# EAGLE design TA 2021 V.2 (EAGLE 7.2.0)
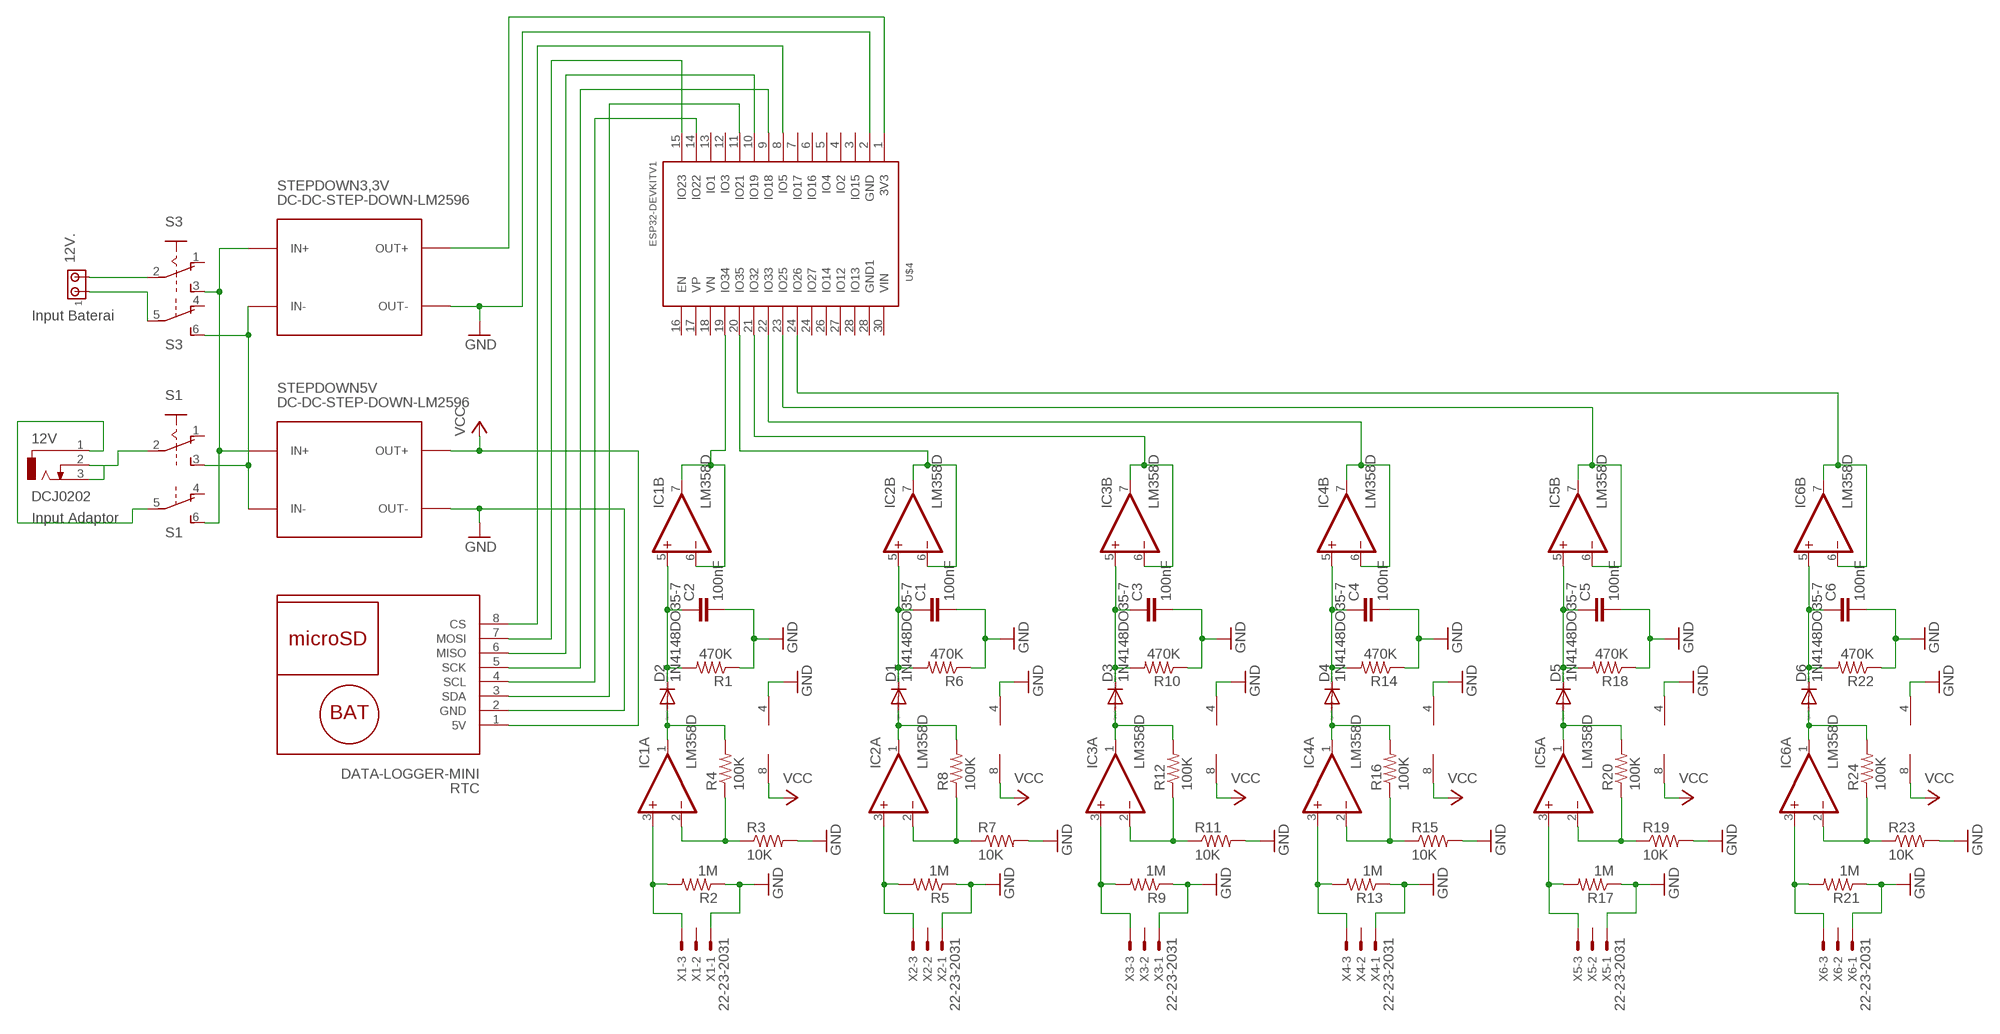
[diagram p0: schematic, sheet 1]

## Parts
12V  DCJ0202  [DCJ0202]
12V.  MTA02-156  [1X2MTA]
C1  100nF  C-EU075-032X103  [C075-032X103]
C2  100nF  C-EU075-032X103  [C075-032X103]
C3  100nF  C-EU075-032X103  [C075-032X103]
C4  100nF  C-EU075-032X103  [C075-032X103]
C5  100nF  C-EU075-032X103  [C075-032X103]
C6  100nF  C-EU075-032X103  [C075-032X103]
D1  1N4148DO35-7  [DO35-7]
D2  1N4148DO35-7  [DO35-7]
D3  1N4148DO35-7  [DO35-7]
D4  1N4148DO35-7  [DO35-7]
D5  1N4148DO35-7  [DO35-7]
D6  1N4148DO35-7  [DO35-7]
IC1  LM358D  [SO08]
IC2  LM358D  [SO08]
IC3  LM358D  [SO08]
IC4  LM358D  [SO08]
IC5  LM358D  [SO08]
IC6  LM358D  [SO08]
R1  470K  R-US_0207/10  [0207/10]
R2  1M  R-US_0207/10  [0207/10]
R3  10K  R-US_0207/10  [0207/10]
R4  100K  R-US_0207/10  [0207/10]
R5  1M  R-US_0207/10  [0207/10]
R6  470K  R-US_0207/10  [0207/10]
R7  10K  R-US_0207/10  [0207/10]
R8  100K  R-US_0207/10  [0207/10]
R9  1M  R-US_0207/10  [0207/10]
R10  470K  R-US_0207/10  [0207/10]
R11  10K  R-US_0207/10  [0207/10]
R12  100K  R-US_0207/10  [0207/10]
R13  1M  R-US_0207/10  [0207/10]
R14  470K  R-US_0207/10  [0207/10]
R15  10K  R-US_0207/10  [0207/10]
R16  100K  R-US_0207/10  [0207/10]
R17  1M  R-US_0207/10  [0207/10]
R18  470K  R-US_0207/10  [0207/10]
R19  10K  R-US_0207/10  [0207/10]
R20  100K  R-US_0207/10  [0207/10]
R21  1M  R-US_0207/10  [0207/10]
R22  470K  R-US_0207/10  [0207/10]
R23  10K  R-US_0207/10  [0207/10]
R24  100K  R-US_0207/10  [0207/10]
RTC  DATA-LOGGER-MINI  [DATA-LOGGER-MINI]
S1  A68-A31  [A68-A31]
S3  A68-A31  [A68-A31]
STEPDOWN3,3V  DC-DC-STEP-DOWN-LM2596  [DC-DC-STEP-DOWN-LM2596]
STEPDOWN5V  DC-DC-STEP-DOWN-LM2596  [DC-DC-STEP-DOWN-LM2596]
U$4  ESP32DEVKITV1  [ESP32-DEVKITV1]
X1  22-23-2031  [22-23-2031]
X2  22-23-2031  [22-23-2031]
X3  22-23-2031  [22-23-2031]
X4  22-23-2031  [22-23-2031]
X5  22-23-2031  [22-23-2031]
X6  22-23-2031  [22-23-2031]

## Nets
N$1: 12V..2 S3.2(A:P)
N$2: RTC.7(MOSI) U$4.15(IO23)
N$3: S1.6(B:S) S3.3(A:S) STEPDOWN3,3V.IN+ STEPDOWN5V.IN+
N$4: RTC.8(CS) U$4.8(IO5)
N$5: 12V.2 12V.3 S1.2(A:P)
N$6: RTC.6(MISO) U$4.10(IO19)
N$7: 12V..1 S3.5(B:P)
N$8: RTC.5(SCK) U$4.9(IO18)
N$9: 12V.1 S1.5(B:P)
N$10: C1.2 C2.2 C3.2 C4.2 C5.2 C6.2 IC1.4(P:V-) IC2.4(P:V-) IC3.4(P:V-) IC4.4(P:V-) IC5.4(P:V-) IC6.4(P:V-) R1.1 R2.1 R3.2 R5.1 R6.1 R7.2 R9.1 R10.1 R11.2 R13.1 R14.1 R15.2 R17.1 R18.1 R19.2 R21.1 R22.1 R23.2 RTC.2(GND) STEPDOWN3,3V.OUT- STEPDOWN5V.OUT- U$4.2(GND) X1.1 X2.1 X3.1 X4.1 X5.1 X6.1 ; supply symbol labelled GND
N$11: S1.3(A:S) S3.6(B:S) STEPDOWN3,3V.IN- STEPDOWN5V.IN-
N$12: IC2.6(B:-IN) IC2.7(B:OUT) U$4.20(IO35)
N$13: D1.A IC2.1(A:OUT) R8.2
N$15: IC2.2(A:-IN) R7.1 R8.1
N$16: RTC.4(SCL) U$4.14(IO22)
N$17: IC3.6(B:-IN) IC3.7(B:OUT) U$4.21(IO32)
N$18: STEPDOWN3,3V.OUT+ U$4.1(3V3)
N$20: IC4.6(B:-IN) IC4.7(B:OUT) U$4.22(IO33)
N$21: IC5.6(B:-IN) IC5.7(B:OUT) U$4.23(IO25)
N$22: IC6.6(B:-IN) IC6.7(B:OUT) U$4.24(IO26)
N$23: RTC.3(SDA) U$4.11(IO21)
N$24: IC1.3(A:+IN) R2.2 X1.3
N$68: C1.1 D1.C IC2.5(B:+IN) R6.2
N$69: D2.A IC1.1(A:OUT) R4.2
N$70: IC1.2(A:-IN) R3.1 R4.1
N$71: C2.1 D2.C IC1.5(B:+IN) R1.2
N$72: D4.A IC4.1(A:OUT) R16.2
N$73: IC1.6(B:-IN) IC1.7(B:OUT) U$4.19(IO34)
N$74: IC2.3(A:+IN) R5.2 X2.3
N$75: D3.A IC3.1(A:OUT) R12.2
N$77: C3.1 D3.C IC3.5(B:+IN) R10.2
N$78: D6.A IC6.1(A:OUT) R24.2
N$79: IC3.3(A:+IN) R9.2 X3.3
N$80: IC4.2(A:-IN) R15.1 R16.1
N$82: IC6.2(A:-IN) R23.1 R24.1
N$83: IC4.3(A:+IN) R13.2 X4.3
N$84: D5.A IC5.1(A:OUT) R20.2
N$85: IC5.2(A:-IN) R19.1 R20.1
N$86: C5.1 D5.C IC5.5(B:+IN) R18.2
N$88: IC5.3(A:+IN) R17.2 X5.3
N$91: IC6.3(A:+IN) R21.2 X6.3
N$99: IC3.2(A:-IN) R11.1 R12.1
N$155: C6.1 D6.C IC6.5(B:+IN) R22.2
N$185: C4.1 D4.C IC4.5(B:+IN) R14.2
VCC: IC1.8(P:V+) IC2.8(P:V+) IC3.8(P:V+) IC4.8(P:V+) IC5.8(P:V+) IC6.8(P:V+) RTC.1(5V) STEPDOWN5V.OUT+
Unconnected: S1.1(A:O) S1.4(B:O) S3.1(A:O) S3.4(B:O) U$4.3(IO15) U$4.4(IO2) U$4.5(IO4) U$4.6(IO16) U$4.7(IO17) U$4.12(IO3) U$4.13(IO1) U$4.16(EN) U$4.17(VP) U$4.18(VN) U$4.24(IO27) U$4.26(IO14) U$4.27(IO12) U$4.28(GND1) U$4.28(IO13) U$4.30(VIN) X1.2 X2.2 X3.2 X4.2 X5.2 X6.2

## Notes on the sheet
- Input Baterai
- Input Adaptor

## Library data of the parts
12V = con-jack:DCJ0202: DC POWER JACK Source: DCJ0202.pdf; OC_FARNELL: unknown; OC_NEWARK: unknown
12V. = con-amp:MTA02-156: AMP connector
C1-C6 = rcl:C-EU: CAPACITOR, European symbol
D1-D6 = diode:1N4148: DIODE high speed (Philips)
IC1-IC6 = linear:LM358: OP AMP also LM158; LM258; LM2904 Source: http://cache.national.com/ds/LM/LM158.pdf
R1-R24 = resistor:R-US_: RESISTOR, American symbol
RTC = diy-modules (1):DATA-LOGGER-MINI: Mini Data Logger with microSD card and battery powered RTC based on DS1307 chip Arduino library for DS1307 and description are available here: https://www.pjrc.com/teensy/td_libs_DS1307RTC.html Tutorial how to use SD card with Arduino: https://www.arduino.cc/en/reference/SD Click here to find device on ebay.com <http://www.ebay.com/sch/mini+data+logger+arduino>
S1 S3 = switch:A68-A31: SLIDING SWITCH Siemens, distributor Buerklin, 11G766
STEPDOWN3,3V STEPDOWN5V = diy-modules:DC-DC-STEP-DOWN-LM2596: DC/DC Step-Down Regulator based on LM2596-ADJ chip
U$4 = ESP32-DEVKITV1:ESP32DEVKITV1
X1-X6 = con-molex:22-23-2031: .100" (2.54mm) Center Header - 3 Pin; MF: MOLEX; MPN: 22-23-2031; OC_FARNELL: 1462950; OC_NEWARK: 30C0862

## Board
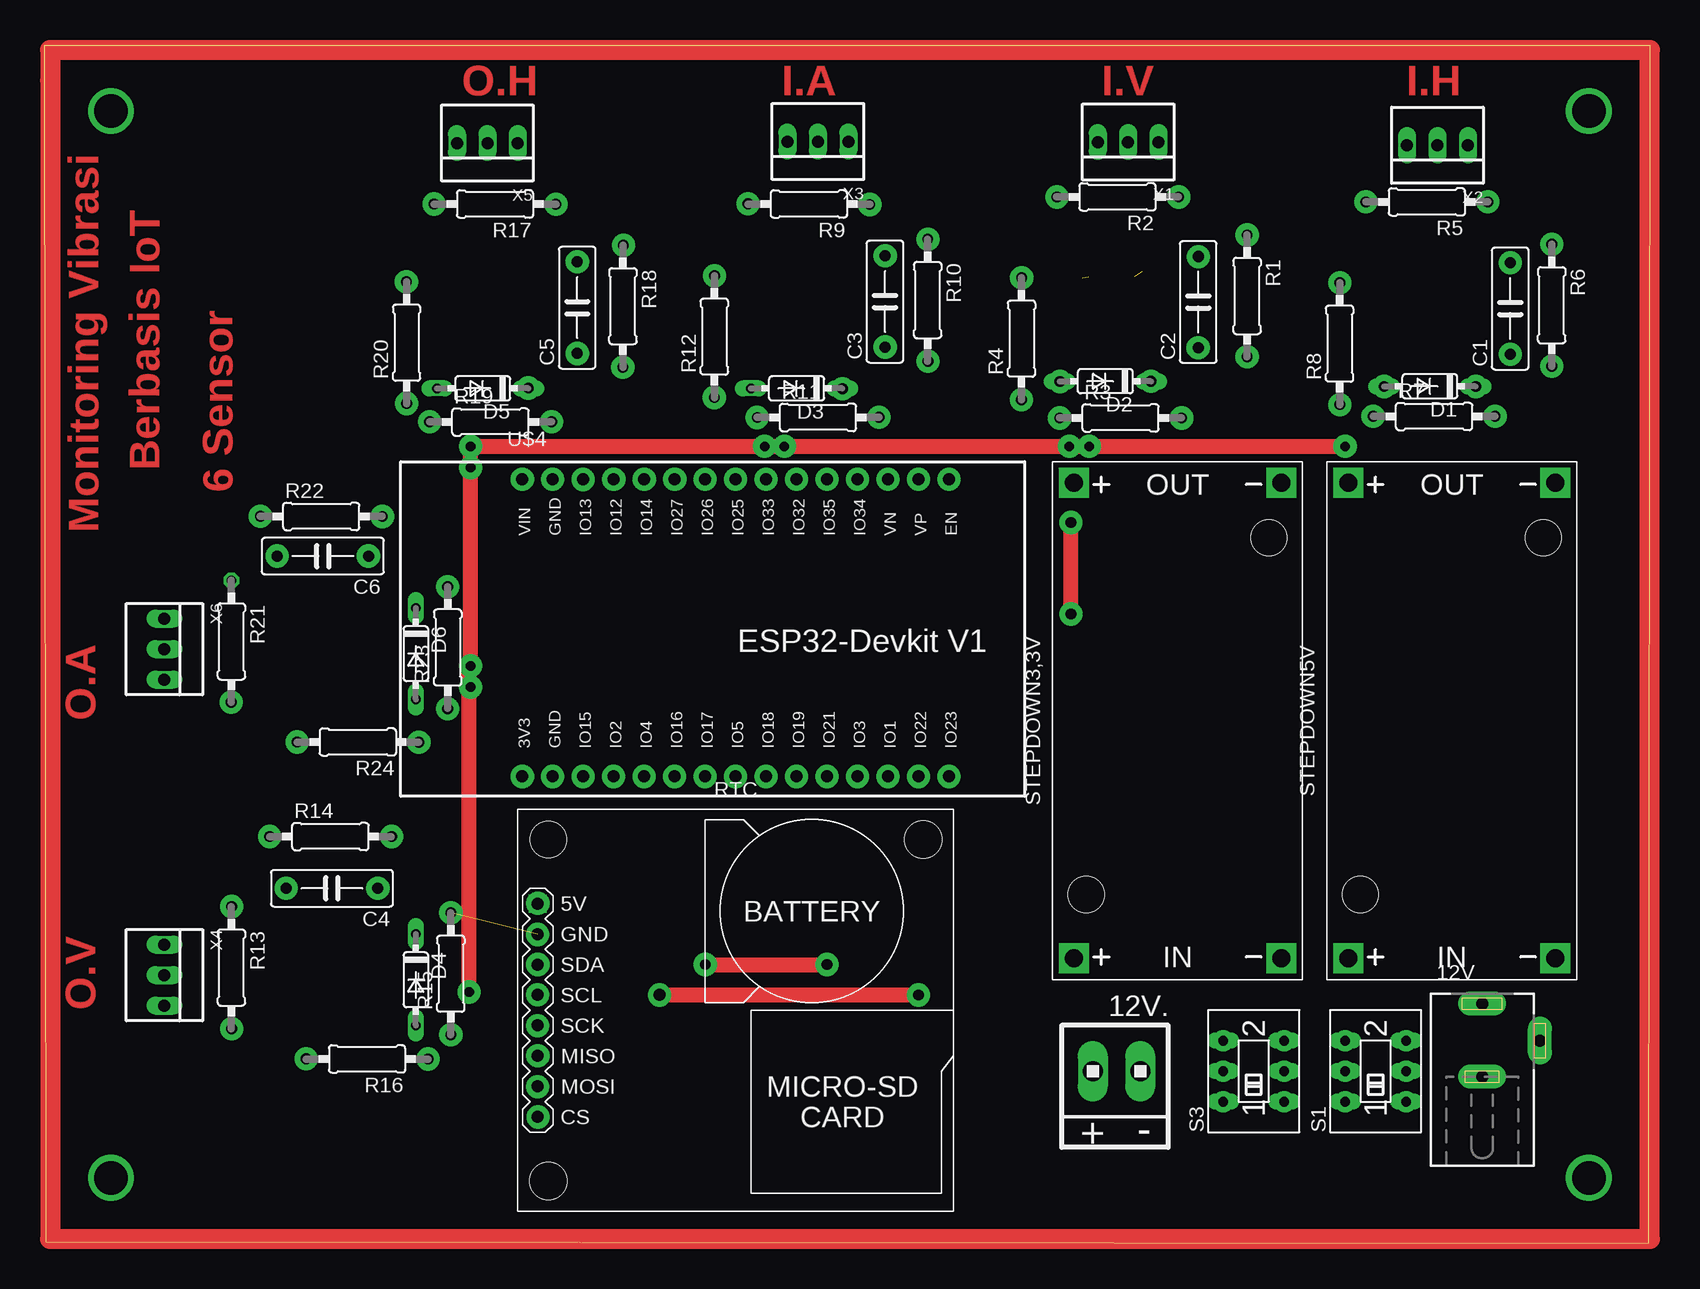
[diagram p1: board, top side]
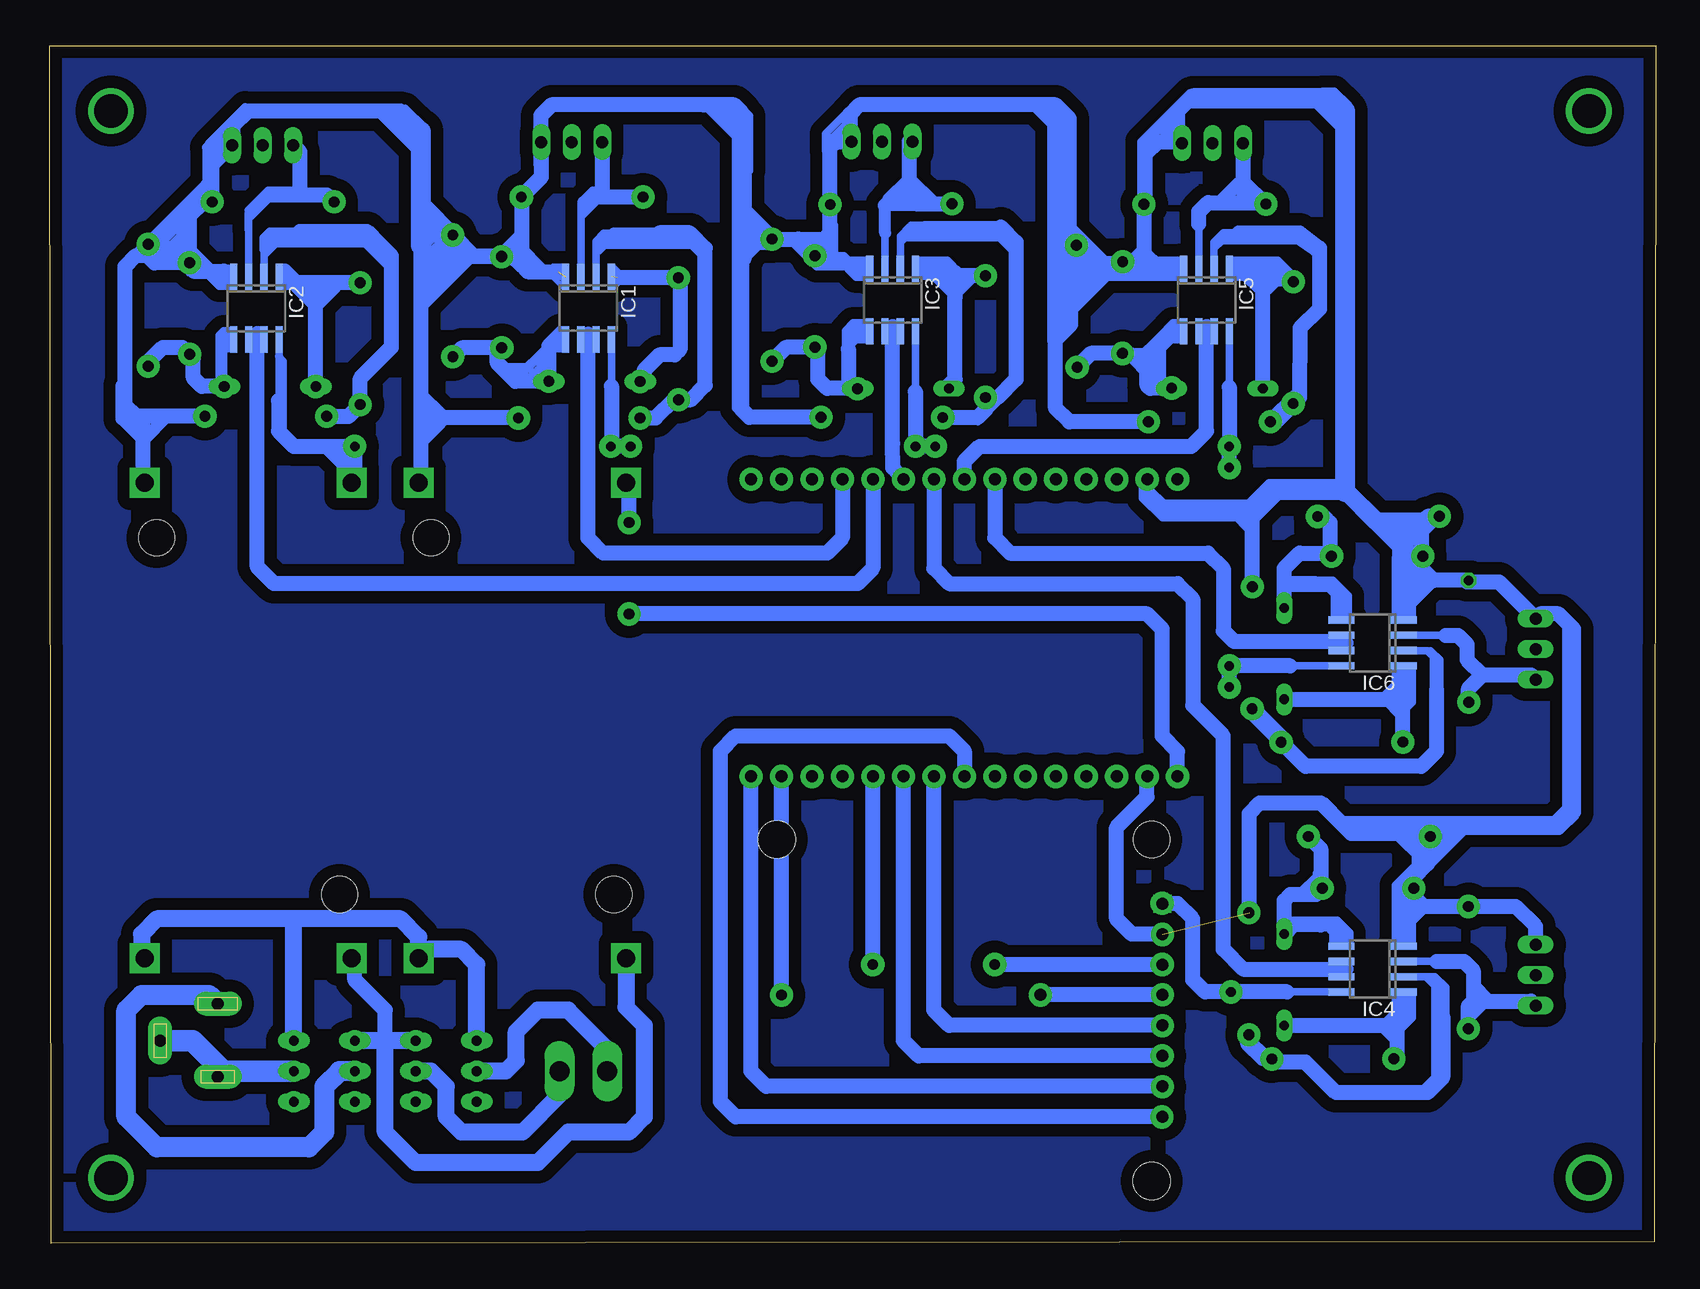
[diagram p2: board, bottom side, seen from below]

Size 133.91 x 99.81 mm. Coordinates in mm from the lower left corner, seen from the top.
Outline: 0.13,0.13 133.78,0 133.91,99.81 0,99.81 0.13,0.13
Copper layers (1*16): Top 0.035mm / dielectric 1.5mm / Bottom 0.035mm
Design rules "default": minimum track width 10mil, minimum drill 24mil, track to track 8mil, track to pad 8mil, pad to pad 8mil, via to via 8mil, smd to smd 8mil, copper to edge 40mil, drill to drill 8mil, minimum pad ring 10mil, minimum via ring 8mil, stop-mask expansion 4mil, vias tented up to drill 0mil, thermal gap 10mil

### Footprints (pad centres in the part's own frame; a part is rotated, then mirrored left to right if it is on the bottom)
DCJ0202 = drill 1 pad 2 long: 1 0,3.1; 2 4.8,0; 3 0,-3
1X2MTA = drill 1.676 long: 1 1.981,0; 2 -1.981,0
C075-032X103 = drill 0.914 octagon: 1 -3.81,0; 2 3.81,0
DO35-7 = drill 0.813 long: A 3.81,0; C -3.81,0
SO08 = smd 0.6 x 2.2: 1 -1.905,-2.6; 2 -0.635,-2.6; 3 0.635,-2.6; 4 1.905,-2.6; 5 1.905,2.6; 6 0.635,2.6; 7 -0.635,2.6; 8 -1.905,2.6
0207/10 = drill 0.813 octagon: 1 -5.08,0; 2 5.08,0
DATA-LOGGER-MINI = drill 1 square: 1 -16.51,8.89 | drill 1: 2 -16.51,6.35; 3 -16.51,3.81; 4 -16.51,1.27; 5 -16.51,-1.27; 6 -16.51,-3.81; 7 -16.51,-6.35; 8 -16.51,-8.89 | hole 3: -15.621,14.224 | hole 3.1: -15.621,-14.224; 15.621,14.224
A68-A31 = drill 0.813 long: 1 -2.54,-2.54; 2 0,-2.54; 3 2.54,-2.54; 4 -2.54,2.54; 5 0,2.54; 6 2.54,2.54
DC-DC-STEP-DOWN-LM2596 = drill 1.5 pad 2.5 square: IN+ -19.812,8.636; IN- -19.812,-8.636; OUT+ 19.812,8.636; OUT- 19.812,-8.636 | hole 3: -14.478,7.62; 15.24,-7.62
ESP32-DEVKITV1 = drill 1 pad 1.93: 1 -22.87,-13.54; 2 -20.33,-13.54; 3 -17.79,-13.54; 4 -15.25,-13.54; 5 -12.71,-13.54; 6 -10.17,-13.54; 7 -7.63,-13.54; 8 -5.09,-13.54; 9 -2.55,-13.54; 10 -0.01,-13.54; 11 2.53,-13.54; 12 5.07,-13.54; 13 7.61,-13.54; 14 10.15,-13.54; 15 12.69,-13.54; 16 12.69,11.23; 17 10.15,11.23; 18 7.61,11.23; 19 5.07,11.23; 20 2.53,11.23; 21 -0.01,11.23; 22 -2.55,11.23; 23 -5.09,11.23; 24 -7.63,11.23; 25 -10.17,11.23; 26 -12.71,11.23; 27 -15.25,11.23; 28 -17.79,11.23; 29 -20.33,11.23; 30 -22.87,11.23
22-23-2031 = drill 1 long: 1 -2.54,0; 2 0,0; 3 2.54,0

### Placement (x,y rotation side)
12V  119.89,16.89 0 top
12V.  89.41,14.35 180 top
C1  122.22,77.9 90 top
C2  96.22,78.45 90 top
C3  70.1,78.49 90 top
C4  24,29.59 180 top
C5  44.45,77.98 90 top
C6  23.24,57.28 180 top
D1  115.52,71.42 180 top
D2  88.47,71.84 180 top
D3  62.74,71.25 180 top
D4  30.99,21.97 270 top
D5  36.58,71.25 180 top
D6  30.99,49.15 270 top
IC1  88.98,77.94 180 bottom
IC2  116.66,77.93 180 bottom
IC3  63.63,78.61 180 bottom
IC4  23.62,22.86 90 bottom
IC5  37.47,78.61 180 bottom
IC6  23.62,50.04 90 bottom
R1  100.28,78.96 270 top
R2  89.48,87.21 180 top
R3  89.74,68.8 0 top
R4  81.48,75.4 90 top
R5  115.27,86.79 180 top
R6  125.68,78.18 270 top
R7  115.87,68.91 0 top
R8  108,74.98 90 top
R9  63.75,86.61 180 top
R10  73.66,78.61 270 top
R11  64.52,68.83 0 top
R12  55.88,75.56 90 top
R13  15.62,22.99 270 top
R14  23.88,33.91 0 top
R15  33.91,22.48 90 top
R16  26.92,15.37 180 top
R17  37.59,86.61 180 top
R18  48.26,78.1 270 top
R19  37.21,68.45 0 top
R20  30.23,75.06 90 top
R21  15.62,50.16 270 top
R22  23.11,60.58 0 top
R23  33.66,49.66 90 top
R24  26.16,41.78 180 top
RTC  57.66,19.43 0 top
S1  111,14.35 90 top
S3  100.84,14.35 90 top
STEPDOWN3,3V  94.49,43.56 90 top
STEPDOWN5V  117.35,43.56 90 top
U$4  62.74,52.45 0 top
X1  90.37,91.78 180 top
X2  116.15,91.52 180 top
X3  64.52,91.82 180 top
X4  10.03,22.35 270 top
X5  36.96,91.69 180 top
X6  10.03,49.53 270 top

### Tracks (layer width: path | path; a pad name or v marks a point on that pad's centre or on a via)
N$1
  Bottom 1.422: 12V..2 91.39,12.37 94.49,9.27 99.57,9.27 100.84,10.54 100.84,13.08 102.11,14.35 S3.2
N$2
  Bottom 1.27: RTC.7 74.17,13.08 75.44,14.35 U$4.15
N$3
  Bottom 1.27: 105.92,16.89 105.92,19.43 108.46,21.97 108.46,23.5
  Bottom 1.422: S3.3 105.92,16.89 | 105.92,16.89 S1.6 | STEPDOWN3,3V.IN+ 85.85,19.69 84.33,18.16 84.33,10.54 85.6,9.27 90.68,9.27 93.22,6.73 103.38,6.73 105.92,9.27 105.92,16.89
  Bottom 1.778: 108.46,23.5 STEPDOWN5V.IN+
N$4
  Bottom 1.27: RTC.8 76.71,10.54 77.98,11.81 77.98,41.02 76.71,42.29 58.93,42.29 57.66,41.02 U$4.8
N$5
  Bottom 1.778: S1.2 119.43,14.35 | 119.43,14.35 12V.3 | 12V.2 121.97,16.89 119.43,14.35
N$6
  Bottom 1.27: RTC.6 61.47,15.62 62.74,16.89 U$4.10
N$7
  Bottom 1.422: 12V..1 87.43,16.18 90.68,19.43 93.22,19.43 95,17.65 95,15.24 95.89,14.35 S3.5
N$8
  Bottom 1.27: RTC.5 58.93,18.16 60.2,19.43 U$4.9
N$9
  Bottom 1.676: S1.5 109.73,14.35 111,13.08 111,9.27 112.27,8 124.97,8 127.51,10.54 127.51,19.43 126.24,20.7 120.6,20.7 12V.1
N$10  (via drill 0.9 pad 1.93)  (2 unrouted)
  Bottom 0.61: 119.38,81.03 119.07,81.03 IC2.4 | IC4.4 21.02,27.25 | IC5.4 41.97,81.21 43.05,82.3 | IC6.4 21.02,54.8 | 76.2,91.69 76.71,92.2 | 76.71,93.85 77.22,94.36 77.72,94.36 76.58,93.22 76.58,92.71 78.74,94.87 79.38,94.87 76.71,92.2 | 76.71,91.69 76.71,92.2 | IC3.4 66.99,81.21 68.07,82.3 C3.2
  Bottom 0.813: 44.96,80.64 45.72,80.64 48.77,77.6 48.77,78.23 46.23,80.77 46.61,80.77 48.26,82.42 48.26,79.63 48.01,79.38 48.01,79.88 47.24,80.64 47.5,80.64 47.88,81.03
  Bottom 1.016: 124.08,68.83 124.21,68.83 125.98,67.06 126.24,67.06 127.89,68.71 127.89,71.5 127.64,71.75
  Bottom 1.27: R2.1 94.56,83.91 | R2.1 94.56,81.5 | 94.56,81.5 94.06,80.99 91.52,80.99 | R3.2 102.18,68.8 102.95,69.56 | 102.95,69.56 102.95,83.15 102.06,84.04 v100.29,84.04 R1.1 98.5,82.26 C2.2 95.33,82.26 94.56,81.5 | X1.1 92.91,89.92 | 92.91,89.92 92.91,88.86 R2.1 | C1.2 125.15,81.71 125.73,82.3 | 125.73,82.3 125.73,83.21 R6.1 | C1.2 122.23,85.67 121.16,86.74 120.4,86.74 R5.1 120.35,91.36 119.89,91.82 119,91.82 X2.1 118.62,91.59 118.62,93.09 117.35,94.36 104.65,94.36 102.95,92.66 | C1.2 122.23,81.33 121.92,81.03 119.38,81.03 | R7.2 126.11,68.91 | 126.11,68.91 126.7,68.91 127.64,69.85 127.64,71.75 127.64,81.41 126.75,82.3 125.73,82.3 | 71.5,83.69 R10.1 73.91,83.44 74.93,83.44 76.2,82.17 76.2,69.47 75.56,68.83 R11.2 | 71.5,83.69 C3.2 | 20.32,29.08 19.3,28.07 R13.1 11.68,28.07 10.03,26.42 X4.1 | 20.32,29.08 20.32,29.46 C4.2 v20.19,29.6 20.19,30.48 19.05,31.62 19.05,33.66 R14.1 19.05,34.16 25.4,34.16 25.91,34.67 | 21.02,27.25 21.02,28.38 20.32,29.08 | R15.2 33.91,35.81 33.02,36.7 27.94,36.7 25.91,34.67 | R19.2 48.89,68.45 50.04,69.6 50.04,75.31 | 50.04,75.31 48.77,76.58 48.77,77.6 48.77,82.68 R18.1 47.75,83.18 46.23,81.66 44.58,81.66 C5.2 44.32,81.66 43.69,81.66 43.05,82.3 42.67,82.68 v42.67,86.6 R17.1 42.55,86.74 42.55,90.8 41.53,91.82 39.62,91.82 X5.1 39.88,92.07 39.88,94.36 38.61,95.63 27.18,95.63 25.91,94.36 | R22.1 19.05,60.58 19.56,60.07 | 19.56,60.07 19.56,57.4 v19.44,57.29 | v19.44,57.29 C6.2 | C6.2 19.56,57.15 19.56,56.26 18.54,55.25 R21.1 15.75,55.12 13.08,55.12 X6.1 9.65,52.45 8.13,52.45 6.86,51.18 6.86,35.94 8.13,34.67 25.91,34.67 | 21.02,54.8 21.02,57.34 20.83,57.53 19.69,57.53 v19.44,57.29
  Bottom 1.27: v19.44,57.29 C6.2 | R23.2 33.66,61.21 33.53,61.34 | 19.56,60.07 23.37,60.07 25.91,62.61 32.26,62.61 33.53,61.34 | 126.11,63.37 126.11,68.91 | 102.95,63.37 102.95,69.56 | 76.2,91.69 76.2,94.23 76.83,94.87 79.38,94.87 92.08,94.87 92.96,93.98 92.96,89.97 92.91,89.92 | 50.04,75.31 50.04,75.56 48.89,76.71 48.89,93.73 50.04,94.87 66.42,94.87 67.18,94.11 67.18,91.95 X3.1 68.33,91.82 68.83,91.31 R9.1 v68.83,86.58 68.83,84.2 69.34,83.69 71.5,83.69 | RTC.2 43.69,25.78 44.96,27.05 44.96,34.67 42.42,37.21 U$4.2 | 33.53,61.34 41.15,61.34 42.42,62.61 42.42,63.88
  Bottom 1.676: 102.95,83.15 102.95,92.66 | 76.2,82.17 76.2,91.69 | 25.91,62.61 25.91,94.36
  Bottom 1.778: STEPDOWN5V.OUT- 126.11,63.37 | STEPDOWN3,3V.OUT- 102.95,63.37
N$11
  Bottom 1.422: 113.54,27.05 104.65,27.05 103.12,25.53 STEPDOWN3,3V.IN- 102.36,24.51 99.57,24.51 98.3,23.24 S3.6 | 113.54,27.05 124.97,27.05 126.24,25.78 126.24,24 STEPDOWN5V.IN- | S1.3 113.54,27.05
N$12
  Bottom 0.61: IC2.7 IC2.6 116.8,75.82 116.59,75.82
  Bottom 1.27: U$4.20 65.27,56.27 66.55,54.99 115.19,54.99 116.59,56.39 116.59,75.82
N$13
  Bottom 0.61: 114.3,81.03 114.3,80.98 IC2.1
  Bottom 1.27: R8.2 111.76,80.06 | 111.76,80.06 113.33,80.06 114.3,81.03 | D1.A 111.71,80.01 111.76,80.06
N$14
  Bottom 1.016: 88.98,75.91 88.98,74.74
N$15
  Bottom 0.61: IC2.2 116.03,83.87 | 113.03,84.33 115.57,84.33 116.03,83.87 | 106.43,83.31 114.55,83.31 115.06,83.31 | 115.06,83.31 115.57,83.31 116.08,82.8 116.08,83.82 116.03,83.87 | 115.06,83.31 115.95,82.42
  Bottom 1.27: R7.1 108.99,68.91 R8.1 108,72.08 105.41,74.68 105.41,82.3 106.43,83.31 107.44,84.33 113.03,84.33
N$16  (via drill 0.9 pad 1.93, 1 pad 1.93)
  Top 1.27: v51.31,20.7 v72.9,20.7
  Bottom 1.27: RTC.4 v51.31,20.7 | v72.9,20.7 U$4.14
N$17
  Bottom 0.61: IC3.6 63.63,76.39 IC3.7
  Bottom 1.27: U$4.21 63.62,64.63 63.63,66.67 63.63,76.39
N$18  (via drill 0.9 pad 1.93)
  Top 1.27: v85.6,52.45 v85.6,60.07
  Bottom 1.27: U$4.1 39.87,41.01 41.15,42.29 41.15,51.18 42.42,52.45 v85.6,52.45 | v85.6,60.07 85.6,63.12
  Bottom 1.93: 85.6,63.12 STEPDOWN3,3V.OUT+
N$19
  Bottom 0.61: 118.74,76.07 119.13,76.07 | 119.13,76.07 119.51,75.69 119.51,75.18 | 119.51,71.5 119.51,75.18 | 119.51,75.18 119.13,75.56 119.13,74.68 119,74.55 | 119.13,76.07 119.38,76.07 119.76,75.69 119.76,71.37 119.63,71.25
N$20
  Bottom 0.61: IC4.6 25.84,22.86 IC4.7
  Bottom 1.27: 25.84,22.86 34.42,22.86 36.07,24.51 36.07,42.29 38.61,44.83 38.61,53.72 39.88,54.99 58.93,54.99 60.19,56.25 U$4.22
N$21
  Bottom 0.61: IC5.7 37.47,76.39 IC5.6
  Bottom 1.27: U$4.23 57.65,65.16 56.39,66.42 38.73,66.42 37.47,67.69 37.47,76.39
N$22
  Bottom 0.61: IC6.6 25.84,50.04 IC6.7
  Bottom 1.27: 25.84,50.04 26.35,50.16 35.18,50.16 36.07,51.05 36.07,56.26 37.34,57.53 53.85,57.53 55.11,58.79 U$4.24
N$23  (via drill 0.9 pad 1.93)
  Top 1.27: v55.12,23.24 v65.28,23.24
  Bottom 1.27: RTC.3 v41.16,23.24 v55.12,23.24 | v65.28,23.24 U$4.11
N$24
  Bottom 0.61: IC1.3 89.61,86.79 89.53,86.87 89.28,87.12 | 89.28,87.12 87.72,87.12 87.63,87.21 | 87.88,87.76 88.65,87.76 89.28,87.12
  Bottom 1.27: R2.2 87.63,87.21 88.09,87.21 87.83,87.46 X1.3
N$25
  Bottom 0.61: 118.62,79.76 119.76,79.76 120.9,80.9 120.14,80.9 119.13,79.88 119.13,80.26 119,80.39 119,81.28
N$26
  Bottom 0.61: 113.16,79.76 114.43,79.76 114.55,79.88 114.3,80.14
N$27
  Bottom 0.61: 109.98,80.14 109.98,79.5 111.51,77.98 111.89,77.98 113.54,79.63 112.78,79.63 112.14,78.99 111.13,78.99 110.62,79.5
N$28
  Bottom 0.61: 113.28,87.76 115.19,87.76 115.44,87.76 | 115.44,87.76 117.35,85.85 117.35,84.45 | 115.44,87.76 115.7,87.76 117.35,86.11
N$29
  Bottom 0.61: 118.62,91.44 118.62,91.19 119.89,89.92 119.89,90.42 119.13,91.19 119.38,91.19 119.51,91.06
N$30  (via drill 0.8 pad 1.78)
  other vias: 70.36,63.75
N$31  (via drill 0.8 pad 1.78)
  other vias: 72.9,63.75
N$32  (via drill 0.8 pad 1.78)
  other vias: 75.44,63.75
N$33  (via drill 0.8 pad 1.78)
  other vias: 44.96,38.86
N$34  (via drill 0.8 pad 1.78)
  other vias: 42.42,38.86
N$35  (via drill 0.8 pad 1.78)
  other vias: 39.88,38.86
N$36  (via drill 0.8 pad 1.78)
  other vias: 47.5,38.86
N$37  (via drill 0.8 pad 1.78)
  other vias: 50.04,38.86
N$38  (via drill 0.8 pad 1.78)
  other vias: 52.58,38.86
N$39  (via drill 0.8 pad 1.78)
  other vias: 55.12,38.86
N$40  (via drill 0.8 pad 1.78)
  other vias: 57.66,38.86
N$41  (via drill 0.8 pad 1.78)
  other vias: 67.82,38.86
N$42  (via drill 0.8 pad 1.78)
  other vias: 70.36,38.86
N$43
  Bottom 0.61: 120.65,91.57 120.65,91.69 117.6,94.74 117.6,94.23 119.38,92.46
N$44
  Bottom 0.61: 106.43,94.11 103.25,90.93 103.25,91.69 105.41,93.85 104.9,93.85 103.25,92.2
N$45
  Bottom 0.61: 99.82,84.07 102.62,86.87 102.62,86.23 100.97,84.58 101.6,84.58 102.36,85.34 102.36,84.84 102.11,84.58
N$46
  Bottom 0.61: 35.31,81.91 31.5,81.91 29.97,80.39 30.61,80.39 31.88,81.66 35.18,81.66 35.31,81.53 34.16,81.53 33.53,80.9 33.53,81.03 33.4,81.15 31.75,81.15
N$47
  Bottom 0.61: 101.09,68.83 101.09,69.21 102.74,70.87 102.74,70.48 101.73,69.47
N$48
  Bottom 0.61: 101.22,68.45 101.22,68.2 102.62,66.8 102.62,67.56 101.85,68.33
N$49
  Bottom 0.61: 101.98,67.56 101.85,67.56 100.97,68.45
N$50
  Bottom 0.61: 87.38,87.38 87.76,87.38 89.53,85.6 89.53,86.23 88.9,86.87
N$51
  Bottom 0.406: 90.88,74.45 91.58,74.45 | 91.59,74.45 91.58,74.45 | 91.58,74.45 91.2,74.83
N$52
  Bottom 0.406: 91,76.24 91.42,76.24 92.61,75.04
N$53
  Bottom 0.813: 95.19,72.03 95,72.03 92.23,74.8
N$54
  Bottom 0.813: 92.75,73.67 92.75,73.14 93.74,72.15
N$55  (via drill 0.8 pad 1.78)
  other vias: 113.54,11.81
N$56  (via drill 0.8 pad 1.78)
  other vias: 113.54,14.35
N$57  (via drill 0.8 pad 1.78)
  other vias: 113.54,16.89
N$58  (via drill 0.8 pad 1.78)
  other vias: 108.46,16.89
N$59  (via drill 0.8 pad 1.78)
  other vias: 108.46,14.35
N$60  (via drill 0.8 pad 1.78)
  other vias: 108.46,11.81
N$61  (via drill 0.8 pad 1.78)
  other vias: 98.3,16.89
N$62  (via drill 0.8 pad 1.78)
  other vias: 98.3,14.35
N$63  (via drill 0.8 pad 1.78)
  other vias: 98.3,11.81
N$64  (via drill 0.8 pad 1.78)
  other vias: 103.38,16.89
N$65  (via drill 0.8 pad 1.78)
  other vias: 103.38,11.81
N$66  (via drill 0.8 pad 1.78)
  other vias: 103.38,14.35
N$67
  Bottom 0.813: 93.97,72.94 95.9,72.94 96.19,72.64
N$68
  Bottom 0.61: IC2.5 118.73,75.33 119.38,74.68 119.38,71.48 D1.C
  Bottom 1.27: D1.C 121.21,71.42 121.92,72.14 121.92,73.79 C1.1 122.81,74.68 124.46,74.68 125.68,73.46 R6.2
N$69  (via drill 0.9 pad 1.93)  (1 unrouted)
  Bottom 1.27: 86.56,80.48 v81.5,80.48 R4.2 81.36,80.35 81.36,74.47 81.79,74.04 83.06,74.04 84.33,72.77 84.33,72.17 D2.A 84.15,71.84
N$70
  Bottom 0.61: IC1.2 88.34,83.53 87.71,84.16 86.69,84.16
  Bottom 0.813: 83.06,84.2 85.56,84.2 86.87,84.16
  Bottom 1.016: 86.87,84.16 86.69,84.16 82.5,84.16 | 81.23,70.32 R4.1
  Bottom 1.27: R3.1 83.39,68.8 81.86,70.32 R4.1 80.43,70.32 79.25,71.5 79.25,82.93 80.52,84.2 83.06,84.2
N$71  (via drill 0.9 pad 1.93)
  Bottom 0.61: 91.52,75.53 91.07,75.53 IC1.5
  Bottom 1.27: R1.2 99.52,74.64 C2.1 96.6,74.26 96.6,73.37 95.07,71.84 D2.C v92.28,71.86 92.28,74.77 91.52,75.53
N$72
  Bottom 0.61: IC4.1 21.02,19.24 22.1,18.16
  Bottom 1.27: D4.A 22.1,18.16 21.59,17.65 21.59,15.62 R16.2
N$73
  Bottom 0.61: IC1.6 89.58,75.31 89.03,75.31 89,75.34 IC1.7
  Bottom 1.27: U$4.19 67.81,58.81 69.09,57.53 87.76,57.53 89.03,58.8 89.03,75.31
N$74
  Bottom 0.61: IC2.3 117.3,85.65 115.57,87.38 | 115.06,87.38 115.32,87.38 117.22,85.47
  Bottom 1.27: 115.57,87.38 115.06,87.38 113.03,87.38 | 113.03,87.38 110.77,87.38 R5.2 | 113.03,87.38 113.03,90.93 X2.3
N$75
  Bottom 0.61: 60.96,80.9 61.41,80.9 IC3.1 | 56.9,80.64 56.9,80.39 58.42,78.87 | 57.53,80.14 58.42,79.25 58.42,79.12 58.8,79.12 60.2,80.52 59.31,80.52 58.67,79.88
  Bottom 1.27: R12.2 56.9,80.64 58.17,80.64 58.42,80.9 | 58.42,80.9 60.96,80.9 | D3.A 59.18,71.25 58.42,72.01 58.42,78.87 58.42,79.12 58.42,80.9
N$76
  Bottom 0.61: 35.31,80.52 34.16,80.52 | 33.91,80.52 34.16,80.52 | 34.16,80.52 34.42,80.77 35.05,80.77 35.18,80.9
N$77
  Bottom 0.61: IC3.5 67.12,76.01 67.31,75.82 67.31,75.31 | 67.31,74.68 67.31,74.55 | 65.79,75.31 66.67,75.31 67.31,74.68 | 67.31,74.68 67.31,75.31 | 67.31,75.31 66.93,75.69 66.17,75.69 66.04,75.56
  Bottom 1.27: R10.2 72.52,74.68 C3.1 69.85,74.42 69.85,72.01 69.09,71.25 D3.C 67.31,71.75 67.31,74.55
N$78
  Bottom 0.61: IC6.1 21.02,45.02
  Bottom 1.27: R24.2 21.08,44.83 | 21.08,44.83 21.08,44.97 21.02,45.02 | D6.A 21.59,45.34 21.08,44.83
N$79
  Bottom 0.61: IC3.3 64.26,84.2
  Bottom 1.016: 64.26,84.2 64.26,86.49
  Bottom 1.27: 62.23,87.25 61.59,86.61 R9.2 | 62.23,87.25 62.23,91.82 X3.3 | 62.23,87.25 63.5,87.25 64.26,86.49
N$80
  Bottom 0.61: IC4.2 19.05,22.23 | 19.05,22.23 18.54,22.23 17.78,21.46 17.78,18.92 | 19.05,22.23 19.05,22.1 18.54,21.59
  Bottom 1.27: R16.1 32,15.49 31.62,15.11 29.21,15.11 26.67,12.57 19.05,12.57 17.78,13.84 17.78,18.92
  Bottom 1.422: 32,15.49 32.74,15.49 33.96,16.71 33.96,17.35 R15.1
N$81
  Bottom 0.61: 14.1,20.07 15.24,18.92
N$82
  Bottom 0.61: IC6.2 19.05,49.4 18.92,49.28 18.54,48.9 | 18.54,48.9 18.29,48.64 18.29,46.1 | 18.54,45.85 18.54,48.9
  Bottom 1.27: R23.1 31.24,42.16 R24.1 29.21,39.75 19.56,39.75 18.29,41.02 18.29,46.1
N$83
  Bottom 0.61: IC4.3 18.29,23.5
  Bottom 1.27: R13.2 15.62,19.81 15.24,20.19 | 15.24,20.19 10.41,20.19 X4.3 | 18.29,23.5 16,23.5 15.24,22.73 15.24,20.19
N$84
  Bottom 0.406: IC5.1 34.35,81.21 33.53,80.39
  Bottom 1.27: D5.A 32.77,79.88 32.26,80.39 | 32.26,80.39 30.48,80.39 R20.2 | 33.53,80.39 32.26,80.39
N$85
  Bottom 0.61: IC5.2 36.83,82.93 | 36.83,82.93 36.83,83.44 36.07,84.2 34.8,84.2 | 29.46,83.57 36.2,83.57 36.83,82.93
  Bottom 1.27: R19.1 29.97,70.59 R20.1 29.72,70.48 29.68,76.28 28.05,77.85 28.05,82.93 29.72,84.2 34.8,84.2
N$86
  Bottom 0.61: IC5.5 40.45,76.01 41.15,75.31 41.15,71.25 | 41.15,75.69 41.28,75.69 43.31,73.66 42.8,73.66 41.78,74.68
  Bottom 1.27: D5.C 41.15,71.25 42.16,71.25 42.42,71.5 42.42,72.77 43.31,73.66 43.69,74.04 44.32,74.04 C5.1 47.12,74.17 R18.2
N$87
  Bottom 0.61: 102.62,92.96 104.27,94.61
N$88
  Bottom 0.61: IC5.3 38.1,84.96
  Bottom 1.27: X5.3 34.42,87.63 33.53,86.74 | 33.53,86.74 32.64,86.74 R17.2 | 38.1,84.96 38.1,85.98 37.34,86.74 33.53,86.74
N$89
  Bottom 0.61: 13.84,20.45 14.99,21.59
N$90
  Bottom 0.305: 88.41,74.4 89.39,74.4 89.41,74.41
N$91
  Bottom 0.61: IC6.3 17.53,50.67
  Bottom 1.27: R21.2 15.62,46.23 14.48,47.37 | 14.48,47.37 10.41,47.37 X6.3 | 17.53,50.67 16.51,50.67 15.75,49.91 15.75,48.64 14.48,47.37
N$92
  Bottom 0.305: 90.97,79.59 91.12,79.59 92.13,80.59 91.86,80.59 91.08,79.82 91.08,80.19 91.33,80.43
N$93
  Bottom 0.305: 90.98,81.5 91.97,81.5 92.1,81.37
N$94
  Bottom 0.305: 85.38,80.76 86.12,80.76 86.84,81.48 86.84,81.24 86.74,81.14
N$95
  Bottom 0.305: 86.93,79.59 86.82,79.59 86.4,80.01 86.72,80.01 86.84,79.88
N$96
  Bottom 0.61: 73.28,83.82 75.82,86.36 75.82,84.71 74.8,83.69 74.68,83.69 74.17,84.2 74.55,84.2 75.44,85.09 75.44,85.22 75.31,85.34
N$97
  Bottom 0.61: 75.56,89.41 75.56,93.98 76.71,95.12
N$98
  Bottom 0.61: 76.71,82.17 76.71,69.6 75.69,68.58
N$99
  Bottom 0.406: 62.23,84.71 arc45 62.14,84.93 62.1,84.96 60.83,84.96
  Bottom 0.61: 53.59,82.8 53.72,82.8 55.12,84.2 62.23,84.2 62.99,83.44 | IC3.2 62.99,83.44 | 62.99,83.44 62.99,83.95 62.23,84.71 60.96,84.71
  Bottom 1.016: 60.96,84.71 54.61,84.71
  Bottom 1.27: R11.1 56.52,68.83 55.88,69.47 R12.1 54.86,70.48 53.34,72.01 53.34,83.44 54.61,84.71
N$100
  Bottom 0.61: 79.38,82.3 79.5,82.3 81.03,83.82 87.76,83.82 88.27,83.31
N$101
  Bottom 0.61: 105.66,81.28 105.66,81.41 108.2,83.95 115.44,83.95 116.08,83.31
N$102
  Bottom 0.61: 80.14,83.18 87.63,83.18 88.14,82.68
N$103
  Bottom 0.61: 62.36,83.82 54.48,83.82 54.23,84.07
N$104
  Bottom 0.61: 114.43,69.98 114.43,73.53 114.81,73.91
N$105
  Bottom 0.61: 114.43,67.82 114.43,71.25 114.55,71.37
N$106
  Bottom 0.61: 65.66,76.71 66.93,76.71 67.56,76.07 67.56,71.5
N$107
  Bottom 0.61: 65.79,76.33 66.93,76.33
N$108
  Bottom 0.61: 65.66,80.52 66.55,80.52 67.44,81.41 | 67.44,81.41 68.2,82.17 | 67.44,81.41 69.98,81.41 71.88,83.31
N$109
  Bottom 0.61: 65.53,81.91 67.56,81.91 67.94,82.3 67.69,82.3 66.93,81.53 65.91,81.53 65.91,81.15 66.29,80.77
N$110
  Bottom 0.61: 70.1,81.91 68.07,81.91 66.67,80.52
N$111
  Bottom 0.61: 68.45,82.17 68.45,84.84 68.58,84.96 68.58,83.18 69.34,82.42 69.34,82.93 69.47,83.06 69.72,83.06 69.85,82.93
N$112
  Bottom 0.61: 92.84,81.15 92.84,81.41 94.49,83.06 94.49,82.3 93.6,81.41
N$113
  Bottom 0.61: 94.74,84.2 96.39,82.55 95.76,82.55 95.12,83.18
N$114
  Bottom 0.61: 120.52,81.28 120.52,81.41 121.92,82.8 121.92,82.3 121.29,81.66
N$115
  Bottom 0.61: 122.3,82.8 122.68,82.8 123.7,81.79
N$116
  Bottom 0.61: 96.14,81.91 101.73,81.91 101.98,82.17 99.44,82.17 99.19,82.42 100.71,82.42 100.97,82.68 | 100.08,83.57 100.97,82.68 | 100.97,82.68 102.49,81.15 102.49,81.53 100.71,83.31 101.47,83.31 102.49,82.3 | 100.97,82.68 99.95,82.68 100.33,83.06
N$117
  Bottom 0.61: 98.3,82.17 98.55,82.17 103,77.72
N$118
  Bottom 0.61: 99.57,81.79 99.69,81.79 102.49,78.99 102.49,80.39 101.22,81.66 100.33,81.66 100.2,81.53 100.58,81.53 102.36,79.76
N$119
  Bottom 0.61: 53.34,71.75 53.34,71.63 56.52,68.45
N$120
  Bottom 0.61: 61.72,81.91 59.06,81.91 58.04,80.9
N$121
  Bottom 0.61: 61.47,81.53 59.44,81.53 59.31,81.41
N$122
  Bottom 0.61: 69.09,91.06 69.09,92.58 | 69.09,92.58 66.55,95.12 | 69.22,91.06 69.22,92.46 69.09,92.58
N$123
  Bottom 0.61: 67.56,93.47 67.56,93.22 68.71,92.07 68.33,92.07 67.82,92.58
N$124
  Bottom 0.61: 60.07,86.87 62.1,88.9 62.1,88.39 60.96,87.25
N$125
  Bottom 0.61: 62.48,88.9 62.48,88.77 64.14,87.12
N$126
  Bottom 0.61: 62.99,88.01 62.48,88.01
N$127
  Bottom 0.61: 36.07,86.99 36.07,87.38 | 36.07,87.38 35.94,87.5 34.92,88.52 34.92,87.88 35.56,87.25 | 36.07,87.38 36.32,87.12
N$128
  Bottom 0.61: 32.64,86.99 34.16,88.52
N$129
  Bottom 0.61: 32.51,86.74 32.51,86.99 34.04,88.52
N$130
  Bottom 0.61: 39.5,80.52 41.53,80.52 | 41.53,80.52 42.93,81.91 42.42,81.91 41.28,80.77 39.75,80.77 | 41.53,80.52 45.59,80.52 47.75,82.68 47.24,82.68 45.34,80.77 42.29,80.77 42.16,80.9 42.55,80.9 43.05,81.41 43.43,81.03
N$131
  Bottom 0.61: 39.5,81.91 41.91,81.91 42.29,82.3 42.29,82.17 41.53,81.41 39.88,81.41 39.75,81.53
N$132
  Bottom 0.61: 42.42,83.31 42.42,82.68 41.4,81.66
N$133
  Bottom 0.61: 33.27,79.5 34.16,80.39
N$134
  Bottom 0.61: 31.62,80.01 32.26,79.38
N$135
  Bottom 0.61: 38.86,95.88 42.93,91.82 42.93,91.31 | 42.93,86.87 42.93,91.31 | 42.93,91.31 40.39,93.85 40.39,93.09 41.02,92.46 40.64,92.46 40.51,92.33
N$136
  Bottom 0.61: 39.5,76.71 40.26,76.71 41.4,75.56 41.4,72.39 | 41.4,71.5 41.4,72.39 | 41.4,72.39 41.91,72.9 41.91,72.39 41.66,72.14 41.66,72.52
N$137
  Bottom 0.61: 41.53,74.29 42.67,74.29 | 43.94,74.29 42.67,74.29 | 42.67,74.29 41.66,73.28 41.66,73.79 41.91,74.04
N$138
  Bottom 0.61: 39.62,76.45 39.88,76.45 40.13,76.2
N$139
  Bottom 0.61: 39.62,75.31 40.39,75.31 41.28,74.42
N$140
  Bottom 0.61: 39.5,75.69 40.26,75.69 40.51,75.44
N$141
  Bottom 0.61: 34.04,83.95 36.2,83.95 36.7,83.44
N$142
  Bottom 0.61: 28.26,82.4 28.6,82.66 30.23,83.82
N$143
  Bottom 0.61: 29.72,70.1 29.72,69.98 31.5,68.2 32.26,68.2
N$144
  Bottom 0.61: 51.69,94.61 51.69,94.49 49.15,91.95 49.15,92.71 50.8,94.36
N$145
  Bottom 0.61: 28.7,95.25 26.16,92.71 26.16,93.47 27.94,95.25
N$146
  Bottom 0.61: 25.65,94.74 25.65,94.87 26.8,96.01 27.81,96.01
N$147
  Bottom 0.61: 61.59,86.36 63.75,86.36 63.88,86.49
N$148
  Bottom 0.61: 50.42,75.18 50.42,93.47 50.29,93.6 50.29,92.33 49.53,91.57
  Bottom 1.27: 49.53,91.57 49.53,76.71 49.91,76.33
N$149
  Bottom 0.813: 45.72,81.79 45.85,81.79 48.77,84.71
N$150
  Bottom 0.61: 20.32,52.2 20.32,53.21 18.54,54.99
N$151
  Bottom 0.61: 21.72,51.94 21.72,57.15 21.08,57.79
N$152
  Bottom 0.61: 21.34,52.07 21.34,54.36 21.46,54.48
N$153
  Bottom 0.61: 20.7,52.2 20.7,54.48 | 20.7,54.48 20.7,56.26 20.19,56.77 | 20.32,54.86 20.7,54.48
N$154
  Bottom 0.61: 19.05,54.74 19.05,54.99 20.45,56.39 20.45,55.5 19.43,54.48 20.45,53.47 20.45,54.36 19.94,54.86
N$155
  Bottom 0.61: 25.65,52.07 25.65,53.85 26.8,54.99 27.18,54.99 | IC6.5 26.22,54.04 27.18,54.99 | 27.18,54.99 28.19,54.99 28.45,54.99
  Bottom 1.27: D6.C 30.99,54.99 | 30.99,54.99 30.99,56.26 29.72,57.53 27.3,57.53 C6.1 27.18,57.4 27.18,60.07 27.69,60.58 R22.2 | 28.45,54.99 30.99,54.99
N$156
  Bottom 0.61: 26.8,52.07 26.8,54.1 27.3,54.61 30.61,54.61 30.73,54.74
N$157
  Bottom 0.61: 29.21,55.25 26.92,55.25 25.65,53.98
N$158
  Bottom 0.61: 20.32,48.01 20.32,45.09 20.95,44.45 20.95,45.09 20.57,45.47 20.57,47.62 20.7,47.75
N$159
  Bottom 0.61: 21.72,47.88 21.72,46.48 21.72,46.23 | 21.72,46.23 21.34,45.85 21.34,47.75 21.46,47.88 | 21.72,45.85 21.72,46.23
N$160
  Bottom 0.61: 21.59,46.48 21.84,46.48 22.73,45.59
N$161
  Bottom 0.61: 21.59,44.2 22.35,44.96
N$162
  Bottom 0.61: 18.03,46.1 18.03,48.64 18.8,49.4
N$163
  Bottom 0.61: 31.37,41.4 31.37,41.53 34.04,44.2
N$164
  Bottom 0.61: 18.03,60.33 18.16,60.33 19.43,59.05
N$165
  Bottom 0.61: 33.91,60.45 41.15,60.45 42.8,62.1 42.8,63.63 42.55,63.88
N$166
  Bottom 0.61: 34.04,59.56 35.05,60.58
N$167
  Bottom 0.61: 31.12,62.48 31.24,62.48 33.78,59.94
N$168
  Bottom 0.61: 26.42,63.37 32.26,63.37 34.16,61.47
N$169
  Bottom 0.61: 22.48,60.45 22.99,60.45 25.53,62.99
N$170
  Bottom 0.61: 19.3,60.58 23.49,60.58 23.62,60.45
N$171
  Bottom 0.61: 28.45,94.87 38.99,94.87 39.37,94.49
N$172
  Bottom 0.61: 7.49,51.18 7.49,36.32 8.51,35.31 26.03,35.31 27.56,36.83
N$173
  Bottom 0.61: 21.59,34.04 21.08,34.04 19.43,32.38 19.43,32.64 | 20.32,33.53 20.07,33.53 | 20.07,33.53 19.69,33.53 | 21.72,34.04 21.59,34.04 | 21.59,34.04 19.43,31.88 19.56,31.88 21.59,33.91 20.32,33.91 19.3,32.89 19.43,32.89 20.07,33.53
N$174
  Bottom 0.61: 18.8,31.75 18.54,31.75 16.13,34.16 16.89,34.16 18.92,32.13 18.92,32.77 17.53,34.16
N$175
  Bottom 0.61: 20.32,24.89 20.32,26.8 19.43,27.69 20.19,27.69 20.57,28.07 20.57,27.43 20.19,27.05
N$176
  Bottom 0.61: 20.57,26.8 20.57,25.27 20.7,25.15
N$177
  Bottom 0.61: 21.72,24.89 21.72,28.32 20.83,29.21
N$178
  Bottom 0.61: 21.46,26.8 21.46,25.15
N$179
  Bottom 0.61: 17.53,19.05 17.53,21.34 18.41,22.23
N$180
  Bottom 0.61: 18.03,18.67 18.03,21.46 18.67,22.1
N$181
  Bottom 0.61: 20.32,20.96 20.32,18.8 21.34,17.78 21.34,18.54 20.83,19.05 20.83,20.45 20.57,20.7
N$182
  Bottom 0.61: 21.72,20.83 21.72,19.3 | 21.72,19.3 21.72,18.8 22.1,18.42 | 21.72,19.3 22.48,18.54
N$183
  Bottom 0.61: 21.34,20.83 21.34,19.05 21.46,18.92
N$184
  Bottom 0.61: 21.97,17.02 22.86,17.91
N$185  (via drill 0.9 pad 1.93)
  Bottom 0.61: 25.53,24.89 25.53,25.91 26.16,26.54 | IC4.5 26.22,26.1 26.67,26.54 | 26.67,26.54 27.94,26.54 | 26.16,26.54 26.67,26.54 | 26.16,26.54 26.54,26.92 30.48,26.92 30.61,27.05
  Bottom 1.27: R14.2 27.94,32.89 27.94,29.72 v27.83,29.6 C4.1 28.32,29.08 30.48,29.08 30.99,28.58 D4.C 30.23,26.54 27.94,26.54
N$186
  Bottom 0.61: 26.92,24.77 26.92,25.91 27.43,26.42
N$187
  Bottom 0.61: 26.92,26.29 26.67,26.04 26.67,25.27 26.54,25.15
N$188
  Bottom 0.61: 25.91,25.91 25.91,25.15 25.78,25.02
N$189
  Bottom 0.61: 26.8,26.29 30.23,26.29 30.48,26.54
N$190
  Bottom 0.61: 20.57,30.61 21.72,29.46 21.72,27.94 21.46,27.69 21.46,29.21 20.95,29.72
N$191
  Bottom 0.61: 28.32,30.86 28.32,30.61 29.59,29.34 28.83,29.34 28.19,29.97
N$192
  Bottom 0.61: 19.94,32.13 19.94,31.37 21.72,29.59 21.72,29.84 20.07,31.5 20.07,32.77 20.19,32.89
N$193
  Bottom 0.61: 18.41,21.59 18.41,13.84 19.3,12.95
N$194
  Bottom 0.813: 120.52,88.39 120.78,88.39 | 127.76,81.41 120.9,88.27 120.78,88.39 | 120.78,91.31 120.78,88.39
N$195
  Bottom 0.813: 120.4,87.63 125.6,82.42 123.19,82.42 122.81,82.8 122.81,84.58 122.94,84.71 122.94,83.95 124.33,82.55 123.32,82.55 122.94,82.93
N$196  (via drill 0.9 pad 1.93)
  other vias: 125.69,83.26
N$197  (via drill 0.9 pad 1.93)
  other vias: 120.35,86.79
N$198  (via drill 0.9 pad 1.93)
  other vias: 122.24,81.72
N$199  (via drill 0.9 pad 1.93)
  other vias: 110.19,86.79
N$200  (via drill 0.9 pad 1.93)
  other vias: 120.95,68.92
N$201  (via drill 0.9 pad 1.93)
  other vias: 108.01,80.06
N$202  (via drill 0.9 pad 1.93)
  other vias: 125.69,73.1
N$203  (via drill 0.9 pad 1.93)
  other vias: 122.22,74.09
N$204  (via drill 0.9 pad 1.93)
  other vias: 119.34,71.41
N$205  (via drill 0.9 pad 1.93)
  other vias: 110.79,68.92
N$206  (via drill 0.9 pad 1.93)
  other vias: 108.01,69.9
N$207  (via drill 0.9 pad 1.93)
  other vias: 111.71,71.41
N$208  (via drill 0.9 pad 1.93)
  other vias: 96.22,82.23
N$209  (via drill 0.9 pad 1.93)
  other vias: 100.29,73.88
N$210  (via drill 0.9 pad 1.93)
  other vias: 96.2,74.64
N$211  (via drill 0.9 pad 1.93)
  other vias: 84.68,71.83
N$212  (via drill 0.9 pad 1.93)
  other vias: 84.67,68.78
N$213  (via drill 0.9 pad 1.93)
  other vias: 81.47,70.31
N$214  (via drill 0.9 pad 1.93)
  other vias: 84.43,87.2
N$215  (via drill 0.9 pad 1.93)
  other vias: 94.58,87.2
N$216  (via drill 0.9 pad 1.93)
  other vias: 69.6,68.85
N$217  (via drill 0.9 pad 1.93)
  other vias: 66.56,71.22
N$218  (via drill 0.9 pad 1.93)
  other vias: 70.12,74.7
N$219  (via drill 0.9 pad 1.93)
  other vias: 73.69,73.52
N$220  (via drill 0.9 pad 1.93)
  other vias: 73.67,83.69
N$221  (via drill 0.9 pad 1.93)
  other vias: 70.12,82.3
N$222  (via drill 0.9 pad 1.93)
  other vias: 55.89,80.63
N$223  (via drill 0.9 pad 1.93)
  other vias: 58.69,86.63
N$224  (via drill 0.9 pad 1.93)
  other vias: 55.88,70.5
N$225  (via drill 0.9 pad 1.93)
  other vias: 59.45,68.82
N$226  (via drill 0.9 pad 1.93)
  other vias: 42.32,68.48
N$227  (via drill 0.9 pad 1.93)
  other vias: 40.37,71.29
N$228  (via drill 0.9 pad 1.93)
  other vias: 44.46,74.16
N$229  (via drill 0.9 pad 1.93)
  other vias: 48.25,73.01
N$230  (via drill 0.9 pad 1.93)
  other vias: 44.45,81.8
N$231  (via drill 0.9 pad 1.93)
  other vias: 48.3,83.17
N$232  (via drill 0.9 pad 1.93)
  other vias: 32.52,86.61
N$233  (via drill 0.9 pad 1.93)
  other vias: 30.21,80.14
N$234  (via drill 0.9 pad 1.93)
  other vias: 32.14,68.47
N$235  (via drill 0.9 pad 1.93)
  other vias: 30.24,69.99
N$236  (via drill 0.9 pad 1.93)
  other vias: 18.05,60.59
N$237  (via drill 0.9 pad 1.93)
  other vias: 27.04,57.29
N$238  (via drill 0.9 pad 1.93)
  other vias: 28.21,60.58
N$239  (via drill 0.9 pad 1.93)
  other vias: 15.61,45.1
N$240  (via drill 0.9 pad 1.93)
  other vias: 21.09,41.78
N$241  (via drill 0.9 pad 1.93)
  other vias: 31.24,41.77
N$242  (via drill 0.9 pad 1.93)
  other vias: 33.66,44.56
N$243  (via drill 0.9 pad 1.93)
  other vias: 33.64,54.72
N$244  (via drill 0.9 pad 1.93)
  other vias: 18.81,33.91
N$245  (via drill 0.9 pad 1.93)
  other vias: 28.97,33.91
N$246  (via drill 0.9 pad 1.93)
  other vias: 15.63,28.08
N$247  (via drill 0.9 pad 1.93)
  other vias: 33.92,27.56
N$248  (via drill 0.9 pad 1.93)
  other vias: 15.63,17.89
N$249  (via drill 0.9 pad 1.93)
  other vias: 21.84,15.38
N$250  (via drill 0.9 pad 1.93)
  other vias: 32.02,15.37
N$251  (via drill 0.9 pad 1.93)
  other vias: 33.92,17.4
N$252  (via drill 0.9 pad 1.93)
  other vias: 41.16,28.33
N$253  (via drill 0.9 pad 1.93)
  other vias: 41.15,25.74
N$254  (via drill 0.9 pad 1.93)
  other vias: 41.15,20.71
N$255  (via drill 0.9 pad 1.93)
  other vias: 41.15,18.14
N$256  (via drill 0.9 pad 1.93)
  other vias: 41.16,15.63
N$257  (via drill 0.9 pad 1.93)
  other vias: 41.15,13.04
N$258  (via drill 0.9 pad 1.93)
  other vias: 41.17,10.53
N$259  (via drill 0.9 pad 1.93)
  other vias: 52.59,63.68
N$260  (via drill 0.9 pad 1.93)
  other vias: 50.04,63.68
N$261  (via drill 0.9 pad 1.93)
  other vias: 47.5,63.69
N$262  (via drill 0.9 pad 1.93)
  other vias: 44.95,63.67
N$263  (via drill 0.9 pad 1.93)
  other vias: 39.88,63.68
N$264  (via drill 0.9 pad 1.93)
  other vias: 94.83,68.78
N$265
  Bottom 0.813: 21.5,56.73 21.5,58.34 19.98,59.87 19.98,58.95 20.98,57.95
N$266
  Bottom 0.813: 21.56,56.98 21.56,57.94 23.67,60.05 22.67,60.05 21.16,58.53 21.16,59.12 21.23,59.2
N$267
  pour Bottom (isolate 1.016): 0.51,99.44 133.86,99.44 133.86,0.38 1.78,0.38 arc-90 0.51,1.65
N$268
  Top 1.676: 0.51,96.9 0.51,0.38 133.86,0.38 133.86,99.44 0.51,99.44 0.51,96.9
N$269  (via drill 2.8 pad 3.81)
  other vias: 128.78,94.36
N$270  (via drill 2.8 pad 3.81)
  other vias: 128.78,5.46
N$271  (via drill 2.8 pad 3.81)
  other vias: 5.59,5.46
N$272  (via drill 2.8 pad 3.81)
  other vias: 5.59,94.36
VCC  (via drill 0.8 pad 1.93)
  Top 1.27: v108.46,66.42 v87.12,66.42 v61.72,66.42 36.07,66.42 | v35.56,66.42 36.07,66.42 | 36.07,66.42 35.56,65.91 v35.56,48.13 35.43,48.01 v35.43,20.96
  Bottom 0.61: IC1.8 87.07,71.46 | IC2.8 114.76,70.28 114.81,70.23 | IC3.8 61.72,70.99 | IC5.8 35.56,71.37 | IC6.8 30.48,48.13 | IC4.8 30.73,20.96 | STEPDOWN5V.OUT+ 108.71,63.88 111,66.17 110.49,66.17 108.97,64.64 108.97,65.4 109.47,65.91
  Bottom 1.27: 114.81,70.23 114.81,67.69 113.54,66.42 v108.46,66.42 108.46,63.63 | 87.07,71.46 87.07,66.62 87,66.55 v87.12,66.42 v85.47,66.42 | 61.72,70.99 v61.72,66.42 v60.07,66.42 | 35.56,71.37 v35.56,66.42 v35.56,64.64 | 30.48,48.13 v35.56,48.13 v35.56,46.36 | 30.73,20.96 v35.43,20.96 37.59,20.96 38.61,21.97 38.61,27.05 39.88,28.32 RTC.1
  Bottom 1.778: 108.46,63.63 STEPDOWN5V.OUT+

### Text on the board
Top: O.H | I.A | I.V | I.H | Monitoring Vibrasi | Berbasis IoT | 6 Sensor | O.A | O.V
tNames: + | -